# Altium project AMC_FMC_Carrier v3.PrjPcb (part 9 of 15)

## Sheet SUP_1.5_3.3.SchDoc
size A4; DocumentNumber: 13; SheetNumber: 13; SheetTotal: 30
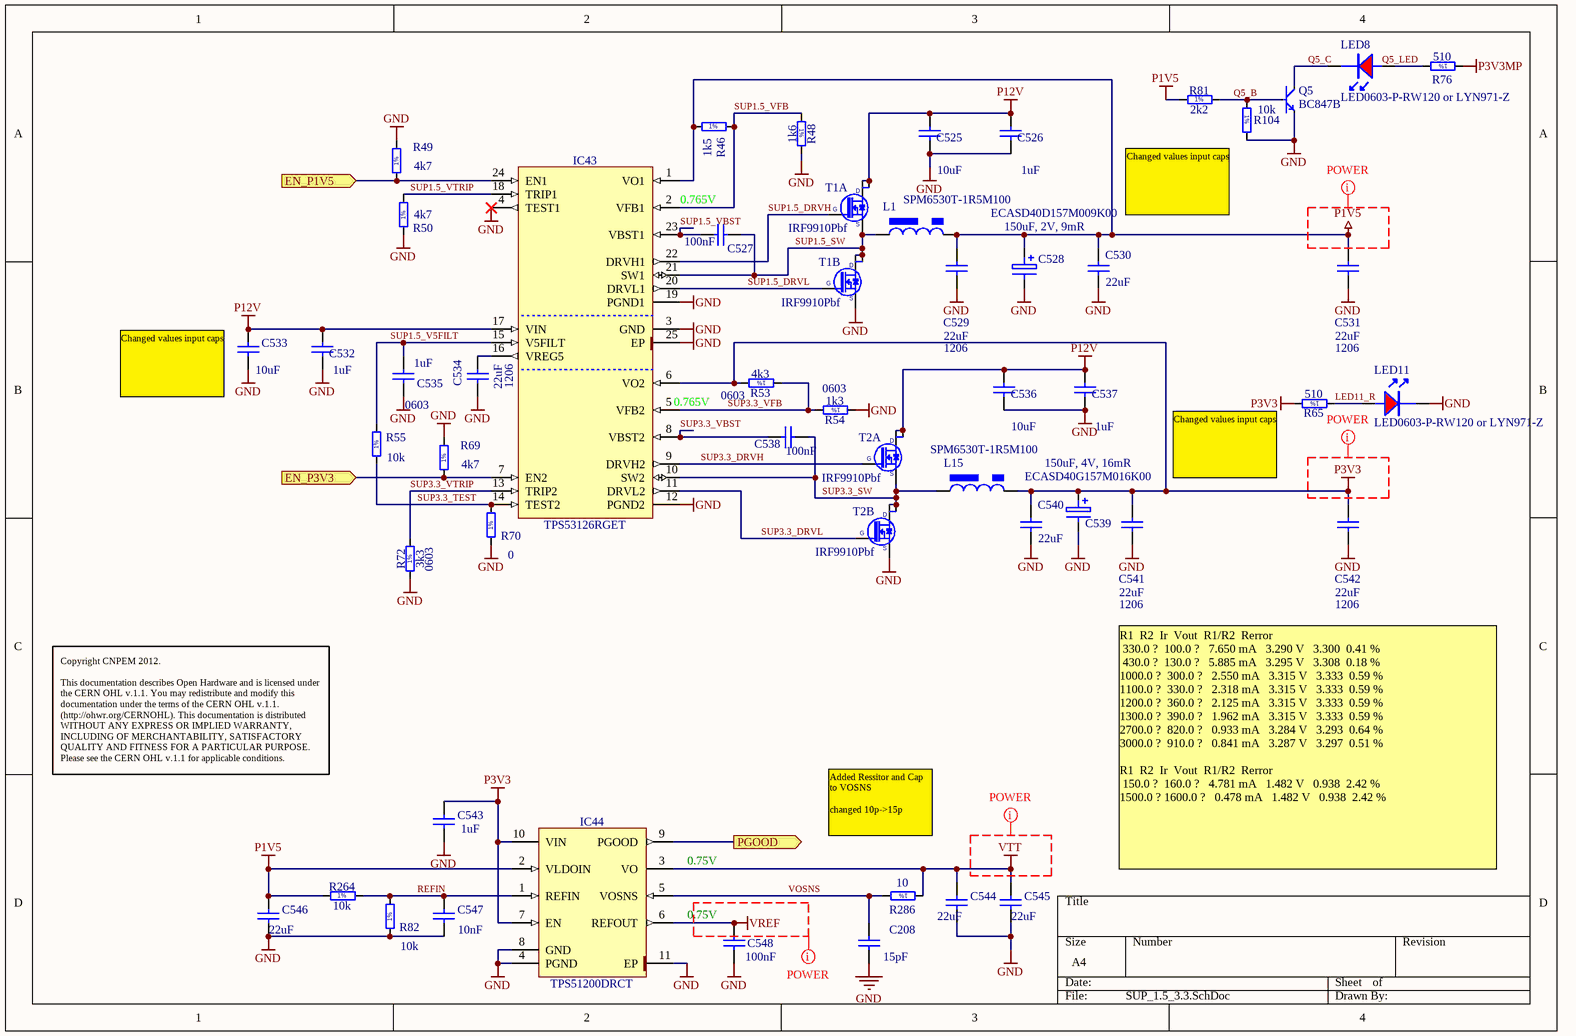
[diagram p16: SUP_1.5_3.3.SchDoc]

### Parts
C208  15pF  [CAPC1005X55N]
C525  10uF  [CAPC2012X135N]
C526  1uF  [CAPC1608X87N]
C527  100nF  [CAPC1005X55N]
C528  ECASD40D157M009K00  value 150uF, 2V, 9mR  [2917_POLY]
C529  22uF  Case: 1206  [CAPC3216X180N]
C530  22uF  [CAPC3216X180N]
C531  22uF  Case: 1206  [CAPC3216X180N]
C532  1uF  [CAPC1608X87N]
C533  10uF  [CAPC2012X135N]
C534  22uF  Case: 1206  [CAPC3216X180N]
C535  1uF  Case: 0603  [CAPC1608X87N]
C536  10uF  [CAPC2012X135N]
C537  1uF  [CAPC1608X87N]
C538  100nF  [CAPC1005X55N]
C539  ECASD40G157M016K00  value 150uF, 4V, 16mR  [2917_POLY]
C540  22uF  [CAPC3216X180N]
C541  22uF  Case: 1206  [CAPC3216X180N]
C542  22uF  Case: 1206  [CAPC3216X180N]
C543  1uF  [CAPC1608X87N]
C544  22uF  [CAPC3216X180N]
C545  22uF  [CAPC3216X180N]
C546  22uF  [CAPC3216X180N]
C547  10nF  [CAPC1005X55N]
C548  100nF  [CAPC0603X33N]
IC43  TPS53126RGET  [QFN50P400X400X100-25N-S255]
IC44  TPS51200DRCT  [SON50P300X300X100-11N-R175X250]
L1  SPM6530T-1R5M100  [IND_TDK_SPM6530]
L15  SPM6530T-1R5M100  [IND_TDK_SPM6530]
LED8  LED0603-P-RW120 or LYN971-Z  [led_0603R]
LED11  LED0603-P-RW120 or LYN971-Z  [led_0603R]
Q5  BC847B  [SOT-23]
R46  1k5  [RESC1608X55N]
R48  1k6  [RESC1608X55N]
R49  4k7  [RESC1005X40N]
R50  4k7  [RESC1005X40N]
R53  4k3  Case: 0603  [RESC1608X55N]
R54  1k3  Case: 0603  [RESC1608X55N]
R55  10k  [RESC1005X40N]
R65  510  [RESC1005X40N]
R69  4k7  [RESC1005X40N]
R70  0  [RESC1005X40N]
R72  3k3  Case: 0603  [RESC1608X55N]
R76  510  [RESC1005X40N]
R81  2k2  [RESC1005X40N]
R82  10k  [RESC1005X40N]
R104  10k  [RESC1005X40N]
R264  10k  [RESC1005X40N]
R286  10  [RESC1005X40N]
T1  IRF9910Pbf  [SOIC127P600X175-8N]  (parts A,B of 2)
T2  IRF9910Pbf  [SOIC127P600X175-8N]  (parts A,B of 2)

### Ports
EN_P1V5 (in), EN_P3V3 (in), PGOOD (out)

### Nets
GND: C208.2 C525.1 C526.1 C528.2 C529.2 C530.2 C531.2 C532.1 C533.1 C534.1 C535.1 C536.1 C537.1 C539.2 C540.2 C541.2 C542.2 C543.1 C544.1 C545.1 C546.1 C547.1 C548.1 IC43.3(GND) IC43.4(TEST1) IC43.12(PGND2) IC43.19(PGND1) IC43.25(EP) IC44.4(PGND) IC44.8(GND) IC44.11(EP) LED11.K Q5.2(E) R48.2 R49.2 R50.1 R54.1 R69.2 R70.1 R72.1 R82.1 R104.2 T1.1(S) T2.1(S)
P1V5: C528.1 C529.1 C530.1 C531.1 C546.2 IC43.1(VO1) IC44.2(VLDOIN) L1.2 R46.1 R81.1 R264.1
P3V3: C539.1 C540.1 C541.1 C542.1 C543.2 IC43.6(VO2) IC44.7(EN) IC44.10(VIN) L15.2 R53.2 R65.2
P3V3MP: R76.1
P12V: C525.2 C526.2 C532.2 C533.2 C536.2 C537.2 IC43.17(VIN) T1.5(D) T1.6(D) T2.5(D) T2.6(D)
VREF: C548.2 IC44.6(REFOUT)
VTT: C544.2 C545.2 IC44.3(VO) R286.1
LED11_R: LED11.A R65.1
PM.1V5_VTT_EN: IC43.24(EN1) R49.1 ; port EN_P1V5
PM.EN_P3V3: IC43.7(EN2) R69.1 ; port EN_P3V3
PM.PGOOD_P1V0: IC44.9(PGOOD) ; port PGOOD
Q5_B: Q5.1(B) R81.2 R104.1
Q5_C: LED8.K Q5.3(C)
REFIN: C547.2 IC44.1(REFIN) R82.2 R264.2
SUP1.5_DRVH: IC43.22(DRVH1) T1.4(G)
SUP1.5_DRVL: IC43.20(DRVL1) T1.2(G)
SUP1.5_SW: C527.1 IC43.21(SW1) L1.1 T1.3(S) T1.7(D) T1.8(D)
SUP1.5_V5FILT: C535.2 IC43.15(V5FILT) R55.2
SUP1.5_VBST: C527.2 IC43.23(VBST1)
SUP1.5_VFB: IC43.2(VFB1) R46.2 R48.1
SUP1.5_VTRIP: IC43.18(TRIP1) R50.2
SUP3.3_DRVH: IC43.9(DRVH2) T2.4(G)
SUP3.3_DRVL: IC43.11(DRVL2) T2.2(G)
SUP3.3_SW: C538.1 IC43.10(SW2) L15.1 T2.3(S) T2.7(D) T2.8(D)
SUP3.3_TEST: IC43.14(TEST2) R55.1 R70.2
SUP3.3_VBST: C538.2 IC43.8(VBST2)
SUP3.3_VFB: IC43.5(VFB2) R53.1 R54.2
SUP3.3_VTRIP: IC43.13(TRIP2) R72.2
VOSNS: C208.1 IC44.5(VOSNS) R286.2
NetC534_2: C534.2 IC43.16(VREG5)
NetLED8_A: LED8.A R76.2

### Layout directives
net class POWER: P1V5, P3V3, VREF, VTT

### Notes on the sheet
- 0.765V
- (near R104) Changed values input caps
- (near C533) Changed values input caps
- (near IC43) 0.765V
- (near R65) Changed values input caps
- Copyright CNPEM 2012.
  This documentation describes Open Hardware and is licensed under the CERN OHL v.1.1. You may redistribute and modify this documentation under the terms of the CERN OHL v.1.1. (http://ohwr.org/CERNOHL). This documentation is distributed WITHOUT ANY EXPRESS OR IMPLIED WARRANTY, INCLUDING OF MERCHANTABILITY, SATISFACTORY QUALITY AND FITNESS FOR A PARTICULAR PURPOSE. Please see the CERN OHL v.1.1 for applicable conditions.
- Added Ressitor and Cap to VOSNS
  changed 10p->15p
- (near IC44) 0.75V
- (near C548) 0.75V
- R1 	R2 	Ir 	Vout 	R1/R2 	Rerror
  330.0 ?	 100.0 ?	  7.650 mA	  3.290 V	  3.300	 0.41 %
  430.0 ?	 130.0 ?	  5.885 mA	  3.295 V	  3.308	 0.18 %
  1000.0 ?	 300.0 ?	  2.550 mA	  3.315 V	  3.333	 0.59 %
  1100.0 ?	 330.0 ?	  2.318 mA	  3.315 V	  3.333	 0.59 %
  1200.0 ?	 360.0 ?	  2.125 mA	  3.315 V	  3.333	 0.59 %
  1300.0 ?	 390.0 ?	  1.962 mA	  3.315 V	  3.333	 0.59 %
  2700.0 ?	 820.0 ?	  0.933 mA	  3.284 V	  3.293	 0.64 %
  3000.0 ?	 910.0 ?	  0.841 mA	  3.287 V	  3.297	 0.51 %
  R1 	R2 	Ir 	Vout 	R1/R2 	Rerror
  150.0 ?	 160.0 ?	  4.781 mA	  1.482 V	  0.938	 2.42 %
  1500.0 ?	1600.0 ?	  0.478 mA	  1.482 V	  0.938	 2.42 %
- Labels drawn without touching a wire or pin: Q5_LED
- (in symbol R0402_0R_JUMPER) 1%
- (in symbol R0402_2K2_1%_0.0625W_100PPM) 1%
- (in symbol R0402_4K7_1%_0.0625W_100PPM) 1%
- (in symbol R0402_10K_1%_0.0625W_100PPM) 1%
- (in symbol R0402_10R_1%_0.0625W_200PPM) 1%
- (in symbol R0402_510R_1%_0.0625W_100PPM) 1%
- (in symbol R0603_1K3_1%_0.1W_100PPM) 1%
- (in symbol R0603_1K5_1%_0.1W_100PPM) 1%
- (in symbol R0603_1K6_1%_0.1W_100PPM) 1%
- (in symbol R0603_3K3_1%_0.1W_100PPM) 1%
- (in symbol R0603_4K3_1%_0.1W_100PPM) 1%

### Library data of the parts
C208 = CC0402_15PF_50V_5%_NP0: Non-polarised capacitor; Part Description: SMD Multilayer Chip Ceramic Capacitor; Manufacturer: GENERIC; Manufacturer1 Part Number: 223886915159; Voltage: 50V; TC: NP0; Tolerance: ±5%; Table: Capacitors SMD; Part Number: CC0402_15PF_50V_5%_NP0; Component Kind: Standard; Component Type: Standard; Pin Count: 2; Value: 15pF; Status: Not Recommended; Manufacturer Part Number: CC0402_15PF_50V_5%_NP0; Case: 0402; Mounted: Yes; Socket: No; SMD: Yes; Manufacturer1 Example: PHYCOMP; Manufacturer1 ComponentHeight: 0.55mm; HelpURL: \\cern.ch\dfs\Applications\Altium\Datasheets\CC0402_NP0_PHYCOMP.pdf; Author: CERN DEM JLC; CreateDate: 2007-12-03; LatestRevisionDate: 2007-12-03
C525 C533 C536 = CC0805_10UF_16V_10%_X5R: Non-polarised capacitor; Part Description: SMD Multilayer Chip Ceramic Capacitor; Manufacturer: GENERIC; Manufacturer1 Part Number: C0805C106K4PAC; Voltage: 16V; TC: X5R; Tolerance: ±10%; Table: Capacitors SMD; Part Number: CC0805_10UF_16V_10%_X5R; Component Kind: Standard; Component Type: Standard; Pin Count: 2; Value: 10uF; Status: Preferred; Manufacturer Part Number: CC0805_10UF_16V_10%_X5R; Case: 0805; Mounted: Yes; Socket: No; SMD: Yes; Manufacturer1 Example: KEMET; Manufacturer1 ComponentHeight: 1.4mm; HelpURL: \\cern.ch\dfs\Applications\Altium\Datasheets\CC1206_X5R_KEMET.pdf; Author: CERN DEM JLC; CreateDate: 2007-12-03; LatestRevisionDate: 2007-12-03
C526 C532 C535 C537 C543 = CC0603_1UF_16V_10%_X7R: as C816 on sheet POWER_Management; Part Number: CC0603_1UF_16V_10%_X7R; Component Kind: Standard; Component Type: Standard; Pin Count: 2; Value: 1uF; Status: Preferred; Manufacturer Part Number: CC0603_1uF_16V_10%_X7R; Mounted: Yes; Socket: No; SMD: Yes; Manufacturer1 Example: PHYCOMP; Manufacturer1 ComponentHeight: 0.87mm; HelpURL: \\cern.ch\dfs\Applications\Altium\Datasheets\CC0805_X5R_PHYCOMP_HC.pdf; Author: CERN DEM JLC
  C526 C532 C537: Case: 0603; CreateDate: 2007-12-03; LatestRevisionDate: 2007-12-03
  C535: CreateDate: 03/12/2007; LatestRevisionDate: 03/12/2007
  C543: Case: 0603; CreateDate: 03/12/2007; LatestRevisionDate: 03/12/2007
C527 C538 = CC0402_100NF_16V_10%_X7R: Non-polarised capacitor; Part Description: SMD Multilayer Chip Ceramic Capacitor; Manufacturer: GENERIC; Manufacturer1 Part Number: 223878715649; Voltage: 16V; TC: X7R; Tolerance: ±10%; Table: Capacitors SMD; Part Number: CC0402_100NF_16V_10%_X7R; Component Kind: Standard; Component Type: Standard; Pin Count: 2; Value: 100nF; Status: Not Recommended; Manufacturer Part Number: CC0402_100NF_16V_10%_X7R; Case: 0402; Mounted: Yes; Socket: No; SMD: Yes; Manufacturer1 Example: PHYCOMP; Manufacturer1 ComponentHeight: 0.55mm; HelpURL: \\cern.ch\dfs\Applications\Altium\Datasheets\CC0402_X7R_PHYCOMP.pdf; Author: CERN DEM JLC; CreateDate: 2007-12-03; LatestRevisionDate: 2007-12-03
C528 = CAP_POLYMER: POLY, 150uF, 2V, ESR: 9mR
C529-C531 C534 C540-C542 C544-C546 = CC1206_22UF_10V_10%_X7R: Non-polarised capacitor; Part Description: SMD Multilayer Chip Ceramic Capacitor; Manufacturer: GENERIC; Manufacturer1 Part Number: GRM31CR71A226KE15L; Voltage: 10V; TC: X7R; Tolerance: ±10%; Table: Capacitors SMD; Part Number: CC1206_22UF_10V_10%_X7R; Component Kind: Standard; Component Type: Standard; Pin Count: 2; Value: 22uF; Status: Preferred; Manufacturer Part Number: CC1206_22UF_10V_10%_X7R; Mounted: Yes; Socket: No; SMD: Yes; Manufacturer1 Example: MURATA; Manufacturer1 ComponentHeight: 1.8mm; HelpURL: \\cern.ch\dfs\Applications\Altium\Datasheets\CC1206_X7R_MURATA_GRM-HI-CAP.pdf; Author: CERN DEM JLC
  C529-C531 C534 C541 C542: CreateDate: 08/06/2010; LatestRevisionDate: 08/06/2010
  C540 C544-C546: Case: 1206; CreateDate: 2010-06-08; LatestRevisionDate: 2010-06-08
C539 = CAP_POLYMER_SMDD: POLY, 150uF, 4V, ESR: 16mR
C547 = CC0402_10NF_16V_10%_X7R: Non-polarised capacitor; Part Description: SMD Multilayer Chip Ceramic Capacitor; Manufacturer: GENERIC; Manufacturer1 Part Number: 223878715636; Voltage: 16V; TC: X7R; Tolerance: ±10%; Table: Capacitors SMD; Part Number: CC0402_10NF_16V_10%_X7R; Component Kind: Standard; Component Type: Standard; Pin Count: 2; Value: 10nF; Status: Not Recommended; Manufacturer Part Number: CC0402_10NF_16V_10%_X7R; Case: 0402; Mounted: Yes; Socket: No; SMD: Yes; Manufacturer1 Example: PHYCOMP; Manufacturer1 ComponentHeight: 0.55mm; HelpURL: \\cern.ch\dfs\Applications\Altium\Datasheets\CC0402_X7R_PHYCOMP.pdf; Author: CERN DEM JLC; CreateDate: 2007-12-03; LatestRevisionDate: 2007-12-03
C548 = CC0201_100NF_6.3V_10%_X5R: as C20 on sheet POWER_Management; Part Number: CC0201_100NF_6.3V_10%_X5R; Component Kind: Standard; Component Type: Standard; Pin Count: 2; Value: 100nF; Status: Not Recommended; Manufacturer Part Number: CC0201_100NF_6.3V_10%_X5R; Case: 0201; Mounted: Yes; Socket: No; SMD: Yes; Manufacturer1 Example: AVX; Manufacturer1 ComponentHeight: 0.33mm; HelpURL: \\cern.ch\dfs\Applications\Altium\Datasheets\CC0201_X5R_AVX.pdf; Author: CERN DEM JLC; CreateDate: 2007-12-03; LatestRevisionDate: 2007-12-03
IC43 = TPS53126RGET: as IC10 on sheet SUP_2.5_FMC; Part Number: TPS53126RGET; Component Kind: Standard; Component Type: Standard; Device: TPS53126RGET; PackageDescription: QFN,0.50mm pitch,square;6 pin X 6 pin,4.15mm X 4.15mm X 1.00mm H body (w/thermal tab 2.55 X 2.55mm),  IPC Medium Density; Part Description: Dual Synchronous Step-Down Controller For Low Voltage Power Rails; Manufacturer Part Number: TPS53126RGET; Pin Count: 25; Case: QFN24; Mounted: Yes; Socket: No; SMD: Yes; ComponentHeight: 1.0mm; Author: CERN DEM JLC; HelpURL: \\cern.ch\dfs\Applications\Altium\Datasheets\TPS53126RGET.pdf; CreateDate: 2010-08-26; LatestRevisionDate: 2010-08-26
IC44 = TPS51200DRCT: Sink/Source DDR Termination Regulator; Part Description: 3.3V Sink/Source DDR Termination Regulator; Manufacturer: TEXAS INSTRUMENTS; Table: Regulators; Part Number: TPS51200DRCT; Component Kind: Standard; Component Type: Standard; Device: TPS51200DRCT; PackageDescription: SON, 0.50mm Pitch, 10-pin, 3.00mm W  X 3.00mm L X 1.00mm Height, (w/thermal tab 1.75 X 2.50 mm), IPC Medium Density; Manufacturer Part Number: TPS51200DRCT; Pin Count: 10; Case: SON10; Mounted: Yes; Socket: No; SMD: Yes; ComponentHeight: 1mm; HelpURL: \\cern.ch\dfs\Applications\Altium\Datasheets\TPS51200DRCT.pdf; Author: CERN DEM JLC; CreateDate: 2/3/2010; LatestRevisionDate: 2/3/2010
L1 L15 = L_POWER_SPM6530T: 1.5uH, 20%, 10mR, 11.5A; Supplier 1: Arrow; Supplier Part Number 1: 51419938S48550N1165
LED8 LED11 = LED_0603R: LED 0603 red; Supplier 1: Newark; Supplier Part Number 1: 22M3004; Supplier 2: Newark; Supplier Part Number 2: 20M0618
Q5 = Q_BC847B: Transistor
R46 = R0603_1K5_1%_0.1W_100PPM: as R247 on sheet SUP_2.5_FMC; Part Number: R0603_1K5_1%_0.1W_100PPM; Component Kind: Standard; Component Type: Standard; Pin Count: 2; Value: 1k5; Status: Preferred; Tolerance: ±1%; Manufacturer Part Number: R0603_1K5_1%_0.1W_100PPM; Case: 0603; Mounted: Yes; Socket: No; SMD: Yes; Manufacturer1 Example: NIC COMPONENT; Manufacturer1 ComponentHeight: 0.55mm; HelpURL: \\cern.ch\dfs\Applications\Altium\Datasheets\R0603_NIC_NRC.pdf; Author: CERN DEM JLC; CreateDate: 2007-12-03; LatestRevisionDate: 2008-03-13
R48 = R0603_1K6_1%_0.1W_100PPM: Resistor - 1%; Part Description: General Purpose Thick Film Chip Resistor; Manufacturer: GENERIC; Manufacturer1 Part Number: NRC06F1601TRF; Power: 0.1W; TC: ±100ppm/°C; Table: Resistors SMD; Part Number: R0603_1K6_1%_0.1W_100PPM; Component Kind: Standard; Component Type: Standard; Pin Count: 2; Value: 1k6; Status: Preferred; Tolerance: ±1%; Manufacturer Part Number: R0603_1K6_1%_0.1W_100PPM; Case: 0603; Mounted: Yes; Socket: No; SMD: Yes; Manufacturer1 Example: NIC COMPONENT; Manufacturer1 ComponentHeight: 0.55mm; HelpURL: \\cern.ch\dfs\Applications\Altium\Datasheets\R0603_NIC_NRC.pdf; Author: CERN DEM JLC; CreateDate: 2007-12-03; LatestRevisionDate: 2008-03-13
R49 R50 R69 = R0402_4K7_1%_0.0625W_100PPM: Resistor - 1%; Part Description: General Purpose Thick Film Chip Resistor; Manufacturer: GENERIC; Manufacturer1 Part Number: 232270674702L; TC: ±100ppm/°C; Table: Resistors SMD; Part Number: R0402_4K7_1%_0.0625W_100PPM; Component Kind: Standard; Component Type: Standard; Pin Count: 2; Value: 4k7; Status: Not recommended; Power: 0.0625W; Tolerance: ±1%; Manufacturer Part Number: R0402_4K7_1%_0.0625W_100PPM; Case: 0402; Mounted: Yes; Socket: No; SMD: Yes; Manufacturer1 Example: YAGEO PHYCOMP; Manufacturer1 ComponentHeight: 0.4mm; HelpURL: \\cern.ch\dfs\Applications\Altium\Datasheets\R0402_Phycomp_RC0402.pdf; Author: CERN DEM JLC; CreateDate: 2007-12-03; LatestRevisionDate: 2012-10-17
R53 = R0603_4K3_1%_0.1W_100PPM: as R84 on sheet SUP_3.3_FMC; Part Number: R0603_4K3_1%_0.1W_100PPM; Component Kind: Standard; Component Type: Standard; Pin Count: 2; Value: 4k3; Status: Preferred; Tolerance: ±1%; Manufacturer Part Number: R0603_4K3_1%_0.1W_100PPM; Mounted: Yes; Socket: No; SMD: Yes; Manufacturer1 Example: NIC COMPONENT; Manufacturer1 ComponentHeight: 0.55mm; HelpURL: \\cern.ch\dfs\Applications\Altium\Datasheets\R0603_NIC_NRC.pdf; Author: CERN DEM JLC; CreateDate: 2007-12-03; LatestRevisionDate: 2008-03-13
R54 = R0603_1K3_1%_0.1W_100PPM: as R86 on sheet SUP_3.3_FMC; Part Number: R0603_1K3_1%_0.1W_100PPM; Component Kind: Standard; Component Type: Standard; Pin Count: 2; Value: 1k3; Status: Preferred; Tolerance: ±1%; Manufacturer Part Number: R0603_1K3_1%_0.1W_100PPM; Mounted: Yes; Socket: No; SMD: Yes; Manufacturer1 Example: NIC COMPONENT; Manufacturer1 ComponentHeight: 0.55mm; HelpURL: \\cern.ch\dfs\Applications\Altium\Datasheets\R0603_NIC_NRC.pdf; Author: CERN DEM JLC; CreateDate: 2007-12-03; LatestRevisionDate: 2008-03-13
R55 R82 R104 R264 = R0402_10K_1%_0.0625W_100PPM: as R37-R40 on sheet POWER_Management; Part Number: R0402_10K_1%_0.0625W_100PPM; Component Kind: Standard; Component Type: Standard; Pin Count: 2; Value: 10k; Status: Not recommended; Power: 0.0625W; Tolerance: ±1%; Manufacturer Part Number: R0402_10K_1%_0.0625W_100PPM; Case: 0402; Mounted: Yes; Socket: No; SMD: Yes; Manufacturer1 Example: YAGEO PHYCOMP; Manufacturer1 ComponentHeight: 0.4mm; HelpURL: \\cern.ch\dfs\Applications\Altium\Datasheets\R0402_Phycomp_RC0402.pdf; Author: CERN DEM JLC; CreateDate: 2007-12-03; LatestRevisionDate: 2012-10-17
R65 R76 = R0402_510R_1%_0.0625W_100PPM: as R74 on sheet SUP_2.5_FMC; Part Number: R0402_510R_1%_0.0625W_100PPM; Component Kind: Standard; Component Type: Standard; Pin Count: 2; Value: 510; Status: Not recommended; Power: 0.0625W; Tolerance: ±1%; Manufacturer Part Number: R0402_510R_1%_0.0625W_100PPM; Case: 0402; Mounted: Yes; Socket: No; SMD: Yes; Manufacturer1 Example: PHYCOMP; Manufacturer1 ComponentHeight: 0.4mm; HelpURL: \\cern.ch\dfs\Applications\Altium\Datasheets\R0402_Phycomp_RC0402.pdf; Author: CERN DEM JLC; CreateDate: 2007-12-03; LatestRevisionDate: 2008-03-13
R70 = R0402_0R_JUMPER: Resistor - 1%; Part Description: 1A (0.05R Max DC Resistance) Zero Ohm Jumper; Manufacturer: GENERIC; Manufacturer1 Part Number: 232270591001L; Table: Resistors SMD; Part Number: R0402_0R_JUMPER; Component Kind: Standard; Component Type: Standard; Pin Count: 2; Value: 0; Status: Not recommended; Manufacturer Part Number: R0402_0R_JUMPER; Case: 0402; Mounted: Yes; Socket: No; SMD: Yes; Manufacturer1 Example: YAGEO PHYCOMP; Manufacturer1 ComponentHeight: 0.4mm; HelpURL: \\cern.ch\dfs\Applications\Altium\Datasheets\R0402_Phycomp_RC0402.pdf; Author: CERN DEM JLC; CreateDate: 2007-12-03; LatestRevisionDate: 2012-10-17
R72 = R0603_3K3_1%_0.1W_100PPM: Resistor - 1%; Part Description: General Purpose Thick Film Chip Resistor; Manufacturer: GENERIC; Manufacturer1 Part Number: NRC06F3301TRF; Power: 0.1W; TC: ±100ppm/°C; Table: Resistors SMD; Part Number: R0603_3K3_1%_0.1W_100PPM; Component Kind: Standard; Component Type: Standard; Pin Count: 2; Value: 3k3; Status: Preferred; Tolerance: ±1%; Manufacturer Part Number: R0603_3K3_1%_0.1W_100PPM; Mounted: Yes; Socket: No; SMD: Yes; Manufacturer1 Example: NIC COMPONENT; Manufacturer1 ComponentHeight: 0.55mm; HelpURL: \\cern.ch\dfs\Applications\Altium\Datasheets\R0603_NIC_NRC.pdf; Author: CERN DEM JLC; CreateDate: 2007-12-03; LatestRevisionDate: 2008-03-13
R81 = R0402_2K2_1%_0.0625W_100PPM: Resistor - 1%; Part Description: General Purpose Thick Film Chip Resistor; Manufacturer: GENERIC; Manufacturer1 Part Number: 232270672202L; TC: ±100ppm/°C; Table: Resistors SMD; Part Number: R0402_2K2_1%_0.0625W_100PPM; Component Kind: Standard; Component Type: Standard; Pin Count: 2; Value: 2k2; Status: Not recommended; Power: 0.0625W; Tolerance: ±1%; Manufacturer Part Number: R0402_2K2_1%_0.0625W_100PPM; Case: 0402; Mounted: Yes; Socket: No; SMD: Yes; Manufacturer1 Example: YAGEO PHYCOMP; Manufacturer1 ComponentHeight: 0.4mm; HelpURL: \\cern.ch\dfs\Applications\Altium\Datasheets\R0402_Phycomp_RC0402.pdf; Author: CERN DEM JLC; CreateDate: 2007-12-03; LatestRevisionDate: 2012-10-17
R286 = R0402_10R_1%_0.0625W_200PPM: Resistor - 1%; Part Description: General Purpose Thick Film Chip Resistor; Manufacturer: GENERIC; Manufacturer1 Part Number: 232270671009L; TC: ±200ppm/°C; Table: Resistors SMD; Part Number: R0402_10R_1%_0.0625W_200PPM; Component Kind: Standard; Component Type: Standard; Pin Count: 2; Value: 10; Status: Not recommended; Power: 0.0625W; Tolerance: ±1%; Manufacturer Part Number: R0402_10R_1%_0.0625W_200PPM; Case: 0402; Mounted: Yes; Socket: No; SMD: Yes; Manufacturer1 Example: YAGEO PHYCOMP; Manufacturer1 ComponentHeight: 0.4mm; HelpURL: \\cern.ch\dfs\Applications\Altium\Datasheets\R0402_Phycomp_RC0402.pdf; Author: CERN DEM JLC; CreateDate: 2009-06-24; LatestRevisionDate: 2012-10-17
T1 T2 = IRF9910Pbf: as T3 on sheet SUP_2.5_FMC; Part Number: IRF9910Pbf; Component Kind: Standard; Component Type: Standard; Device: IRF9910Pbf; PackageDescription: SOIC 8, Pitch 1.27mm - Body 4x5mm, IPC Medium Density; Manufacturer Part Number: IRF9910Pbf; Pin Count: 8; Case: DO8; Mounted: Yes; Socket: No; SMD: Yes; ComponentHeight: 1.75mm; HelpURL: \\cern.ch\dfs\Applications\Altium\Datasheets\IRF9910Pbf.pdf; Author: CERN DEM JLC; CreateDate: 2010-08-30; LatestRevisionDate: 2010-08-30

## Sheet SUP_1.2_1.8.SchDoc
size A4; DocumentNumber: 6; SheetNumber: 6; SheetTotal: 30
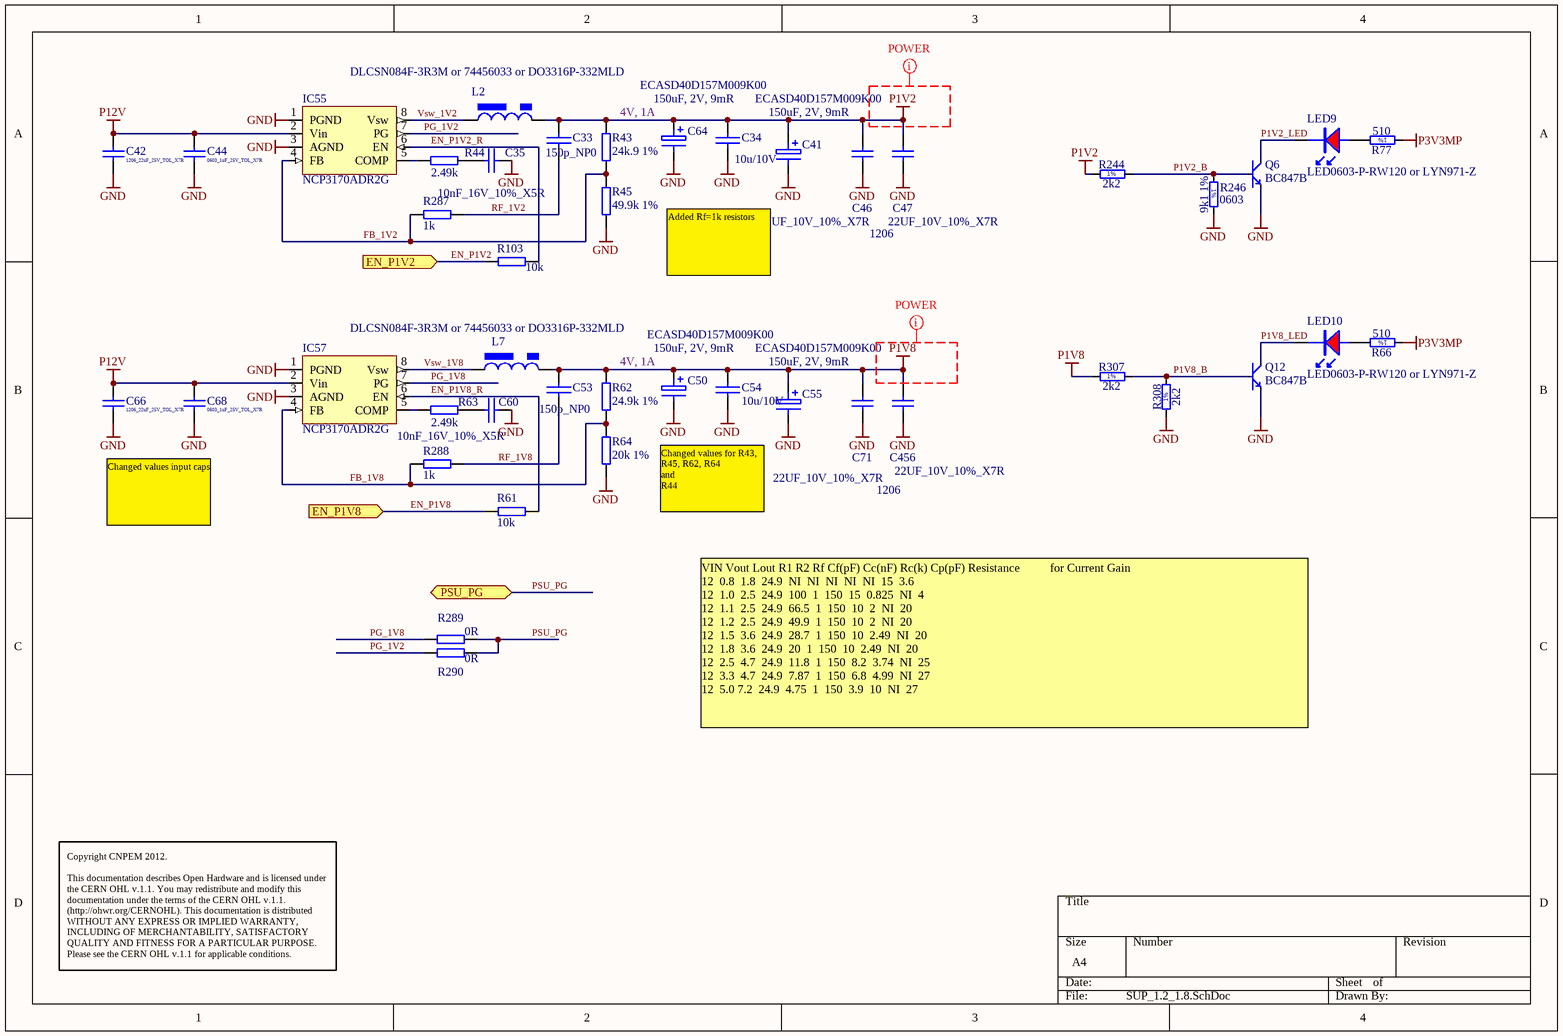
[diagram p17: SUP_1.2_1.8.SchDoc]

### Parts
C33  150p_NP0  [0603C]
C34  10u/10V  [0805C]
C35  10nF_16V_10%_X5R  [0603C]
C41  ECASD40D157M009K00  value 150uF, 2V, 9mR  [2917_POLY]
C42  1206_22uF_25V_TOL_X7R  [CAPC3225X140N]
C44  0603_1uF_25V_TOL_X7R  [CAPC1608X90N]
C46  22UF_10V_10%_X7R  [1206C]
C47  22UF_10V_10%_X7R  Case: 1206  [1206C]
C50  ECASD40D157M009K00  value 150uF, 2V, 9mR  [2917_POLY]
C53  150p_NP0  [0603C]
C54  10u/10V  [0805C]
C55  ECASD40D157M009K00  value 150uF, 2V, 9mR  [2917_POLY]
C60  10nF_16V_10%_X5R  [0603C]
C64  ECASD40D157M009K00  value 150uF, 2V, 9mR  [2917_POLY]
C66  1206_22uF_25V_TOL_X7R  [CAPC3225X140N]
C68  0603_1uF_25V_TOL_X7R  [CAPC1608X90N]
C71  22UF_10V_10%_X7R  [1206C]
C456  22UF_10V_10%_X7R  Case: 1206  [1206C]
IC55  NCP3170ADR2G  [so-8]
IC57  NCP3170ADR2G  [so-8]
L2  DLCSN084F-3R3M or 74456033 or DO3316P-332MLD  [IND_CSN084F]
L7  DLCSN084F-3R3M or 74456033 or DO3316P-332MLD  [IND_CSN084F]
LED9  LED0603-P-RW120 or LYN971-Z  [led_0603R]
LED10  LED0603-P-RW120 or LYN971-Z  [led_0603R]
Q6  BC847B  [SOT-23]
Q12  BC847B  [SOT-23]
R43  24k.9 1%  [0603R]
R44  2.49k  [0603R]
R45  49.9k 1%  [0603R]
R61  10k  [0402R]
R62  24.9k 1%  [0603R]
R63  2.49k  [0603R]
R64  20k 1%  [0603R]
R66  510  [0603R]
R77  510  [0603R]
R103  10k  [0402R]
R244  2k2  [RESC1608X55N]
R246  9k1 1%  Case: 0603  [0603R]
R287  1k  [0603R]
R288  1k  [0603R]
R289  0R  [0402R]
R290  0R  [0402R]
R307  2k2  [RESC1608X55N]
R308  2k2  [RESC1608X55N]

### Ports
EN_P1V2 (in), EN_P1V8 (in), PSU_PG

### Nets
GND: C34.2 C35.2 C41.2 C42.1 C44.1 C46.2 C47.2 C50.2 C54.2 C55.2 C60.2 C64.2 C66.1 C68.1 C71.2 C456.2 IC55.1(PGND) IC55.3(AGND) IC57.1(PGND) IC57.3(AGND) Q6.2(E) Q12.2(E) R45.1 R64.1 R246.2 R308.1
P1V2: C33.1 C34.1 C41.1 C46.1 C47.1 C64.1 L2.2 R43.2 R244.1
P1V8: C50.1 C53.1 C54.1 C55.1 C71.1 C456.1 L7.2 R62.2 R307.1
P3V3MP: R66.1 R77.1
P12V: C42.2 C44.2 C66.2 C68.2 IC55.2(Vin) IC57.2(Vin)
EN_P1V2: R103.1 ; port EN_P1V2  [project net PM.EN_P1V2]
EN_P1V2_R: IC55.6(EN) R103.2
EN_P1V8: R61.1 ; port EN_P1V8  [project net PM.EN_P1V8]
EN_P1V8_R: IC57.6(EN) R61.2
FB_1V2: IC55.4(FB) R43.1 R45.2 R287.2
FB_1V8: IC57.4(FB) R62.1 R64.2 R288.2
P1V2_B: Q6.1(B) R244.2 R246.1
P1V2_LED: LED9.K Q6.3(C)
P1V8_B: Q12.1(B) R307.2 R308.2
P1V8_LED: LED10.K Q12.3(C)
PG_1V2: IC55.7(PG) R290.2
PG_1V8: IC57.7(PG) R289.2
PSU_PG: R289.1 R290.1 ; port PSU_PG  [project net PM.PGOOD_P1V0]
RF_1V2: C33.2 R287.1
RF_1V8: C53.2 R288.1
Vsw_1V2: IC55.8(Vsw) L2.1
Vsw_1V8: IC57.8(Vsw) L7.1
NetC35_1: C35.1 R44.1
NetC60_1: C60.1 R63.1
NetIC55_5: IC55.5(COMP) R44.2
NetIC57_5: IC57.5(COMP) R63.2
NetLED9_A: LED9.A R77.2
NetLED10_A: LED10.A R66.2

### Layout directives
net class POWER: P1V2, P1V8

### Notes on the sheet
- 4V, 1A
- Added Rf=1k resistors
- Changed values input caps
- Changed values for R43, R45, R62, R64
  and
  R44
- VIN	Vout	Lout	R1	R2	Rf	Cf(pF)	Cc(nF)	Rc(k)	Cp(pF) Resistance 									for Current Gain
  12 	0.8 	1.8 	24.9 	NI 	NI 	NI 	NI 	NI 	15 	3.6
  12 	1.0 	2.5 	24.9 	100 	1 	150 	15 	0.825 	NI 	4
  12 	1.1 	2.5 	24.9 	66.5 	1 	150 	10 	2 	NI 	20
  12 	1.2 	2.5 	24.9 	49.9 	1 	150 	10 	2 	NI 	20
  12 	1.5 	3.6 	24.9 	28.7 	1 	150 	10 	2.49 	NI 	20
  12 	1.8 	3.6 	24.9 	20 	1 	150 	10 	2.49 	NI 	20
  12 	2.5 	4.7 	24.9 	11.8 	1 	150 	8.2 	3.74 	NI 	25
  12 	3.3 	4.7 	24.9 	7.87 	1 	150 	6.8 	4.99 	NI 	27
  12 	5.0	7.2 	24.9 	4.75 	1 	150 	3.9 	10 	NI 	27
- Copyright CNPEM 2012.
  This documentation describes Open Hardware and is licensed under the CERN OHL v.1.1. You may redistribute and modify this documentation under the terms of the CERN OHL v.1.1. (http://ohwr.org/CERNOHL). This documentation is distributed WITHOUT ANY EXPRESS OR IMPLIED WARRANTY, INCLUDING OF MERCHANTABILITY, SATISFACTORY QUALITY AND FITNESS FOR A PARTICULAR PURPOSE. Please see the CERN OHL v.1.1 for applicable conditions.
- (in symbol R0402_510R_1%_0.0625W_100PPM) 1%
- (in symbol R0603_2K2_1%_0.1W_100PPM) 1%
- (in symbol R0603_9K1_1%_0.1W_100PPM) 1%

### Library data of the parts
C33 C35 C53 C60 = CAP_SMD_0603: Capacitor SMD
C34 C54 = CAP_SMD_0805: Capacitor SMD; Supplier 1: Farnell; Supplier Part Number 1: 1833812
C41 C50 C55 C64 = CAP_POLYMER: POLY, 150uF, 2V, ESR: 9mR
C42 C66 = Ceramic_1206: MiscInfo: Biggest Cern Footprint [max height]; Document Name: SUP_1.2_1.8.SchDoc; Part Number: Ceramic_1206; FootprintSizeX (mm): 4.65; FootprintSizeY (mm): 2.3; FootprintRectangleArea (mm): 10.7; Thickness (Max) (mm): 1.8; FootprintAlias: 1206
C44 C68 = Ceramic_0603: MiscInfo: Biggest Cern Footprint [max height]; Document Name: SUP_1.2_1.8.SchDoc; Part Number: Ceramic_0603; FootprintSizeX (mm): 3; FootprintSizeY (mm): 1.5; FootprintRectangleArea (mm): 4.5; Thickness (Max) (mm): 0.9; FootprintAlias: 0603
C46 C47 C71 C456 = CC1206_22UF_10V_10%_X7R: as C79 on sheet SUP_2.5_FMC; Part Number: CC1206_22UF_10V_10%_X7R; Component Kind: Standard; Component Type: Standard; Footprint: CAPC3216X180N; Pin Count: 2; Status: Preferred; Manufacturer Part Number: CC1206_22UF_10V_10%_X7R; Mounted: Yes; Socket: No; SMD: Yes; Manufacturer1 Example: MURATA; Manufacturer1 ComponentHeight: 1.8mm; HelpURL: \\cern.ch\dfs\Applications\Altium\Datasheets\CC1206_X7R_MURATA_GRM-HI-CAP.pdf; Author: CERN DEM JLC; CreateDate: 08/06/2010; LatestRevisionDate: 08/06/2010
IC55 IC57 = PWM_NCP3170: 4.5V to 18V, 3A synch buck
L2 L7 = L_POWER_CSN084F_3R3: 3.3uH, 20%, 5.4A, 0.015R
LED9 LED10 = LED_0603R: LED 0603 red; Supplier 1: Newark; Supplier Part Number 1: 22M3004; Supplier 2: Newark; Supplier Part Number 2: 20M0618
Q6 Q12 = Q_BC847B: Transistor
R43-R45 R62-R64 R287 R288 = RES_0603: SMD Resistor
R61 R103 = RES_SMD: SMD Resistor
R66 R77 = R0402_510R_1%_0.0625W_100PPM: as R74 on sheet SUP_2.5_FMC; Part Number: R0402_510R_1%_0.0625W_100PPM; Component Kind: Standard; Component Type: Standard; Footprint: RESC1005X40N; Pin Count: 2; Value: 510; Status: Not recommended; Power: 0.0625W; Tolerance: ±1%; Manufacturer Part Number: R0402_510R_1%_0.0625W_100PPM; Case: 0402; Mounted: Yes; Socket: No; SMD: Yes; Manufacturer1 Example: PHYCOMP; Manufacturer1 ComponentHeight: 0.4mm; HelpURL: \\cern.ch\dfs\Applications\Altium\Datasheets\R0402_Phycomp_RC0402.pdf; Author: CERN DEM JLC; CreateDate: 2007-12-03; LatestRevisionDate: 2008-03-13
R244 R307 R308 = R0603_2K2_1%_0.1W_100PPM: Resistor - 1%; Part Description: General Purpose Thick Film Chip Resistor; Manufacturer: GENERIC; Manufacturer1 Part Number: NRC06F2201TRF; Power: 0.1W; TC: ±100ppm/°C; Table: Resistors SMD; Part Number: R0603_2K2_1%_0.1W_100PPM; Component Kind: Standard; Component Type: Standard; Pin Count: 2; Value: 2k2; Status: Preferred; Tolerance: ±1%; Manufacturer Part Number: R0603_2K2_1%_0.1W_100PPM; Case: 0603; Mounted: Yes; Socket: No; SMD: Yes; Manufacturer1 Example: NIC COMPONENT; Manufacturer1 ComponentHeight: 0.55mm; HelpURL: \\cern.ch\dfs\Applications\Altium\Datasheets\R0603_NIC_NRC.pdf; Author: CERN DEM JLC; CreateDate: 2007-12-03; LatestRevisionDate: 2008-03-13
R246 = R0603_9K1_1%_0.1W_100PPM: Resistor - 1%; Part Description: General Purpose Thick Film Chip Resistor; Manufacturer: GENERIC; Manufacturer1 Part Number: NRC06F9101TRF; Power: 0.1W; TC: ±100ppm/°C; Table: Resistors SMD; Part Number: R0603_9K1_1%_0.1W_100PPM; Component Kind: Standard; Component Type: Standard; Footprint: RESC1608X55N; Pin Count: 2; Value: 9k1; Status: Preferred; Tolerance: ±1%; Manufacturer Part Number: R0603_9K1_1%_0.1W_100PPM; Mounted: Yes; Socket: No; SMD: Yes; Manufacturer1 Example: NIC COMPONENT; Manufacturer1 ComponentHeight: 0.55mm; HelpURL: \\cern.ch\dfs\Applications\Altium\Datasheets\R0603_NIC_NRC.pdf; Author: CERN DEM JLC; CreateDate: 2007-12-03; LatestRevisionDate: 2008-03-13
R289 R290 = RES_0402: SMD Resistor; Supplier 1: Newark; Supplier Part Number 1: 59M6691

## Sheet SUP_1V.SchDoc
size A4; DocumentNumber: 14; SheetNumber: 14; SheetTotal: 30
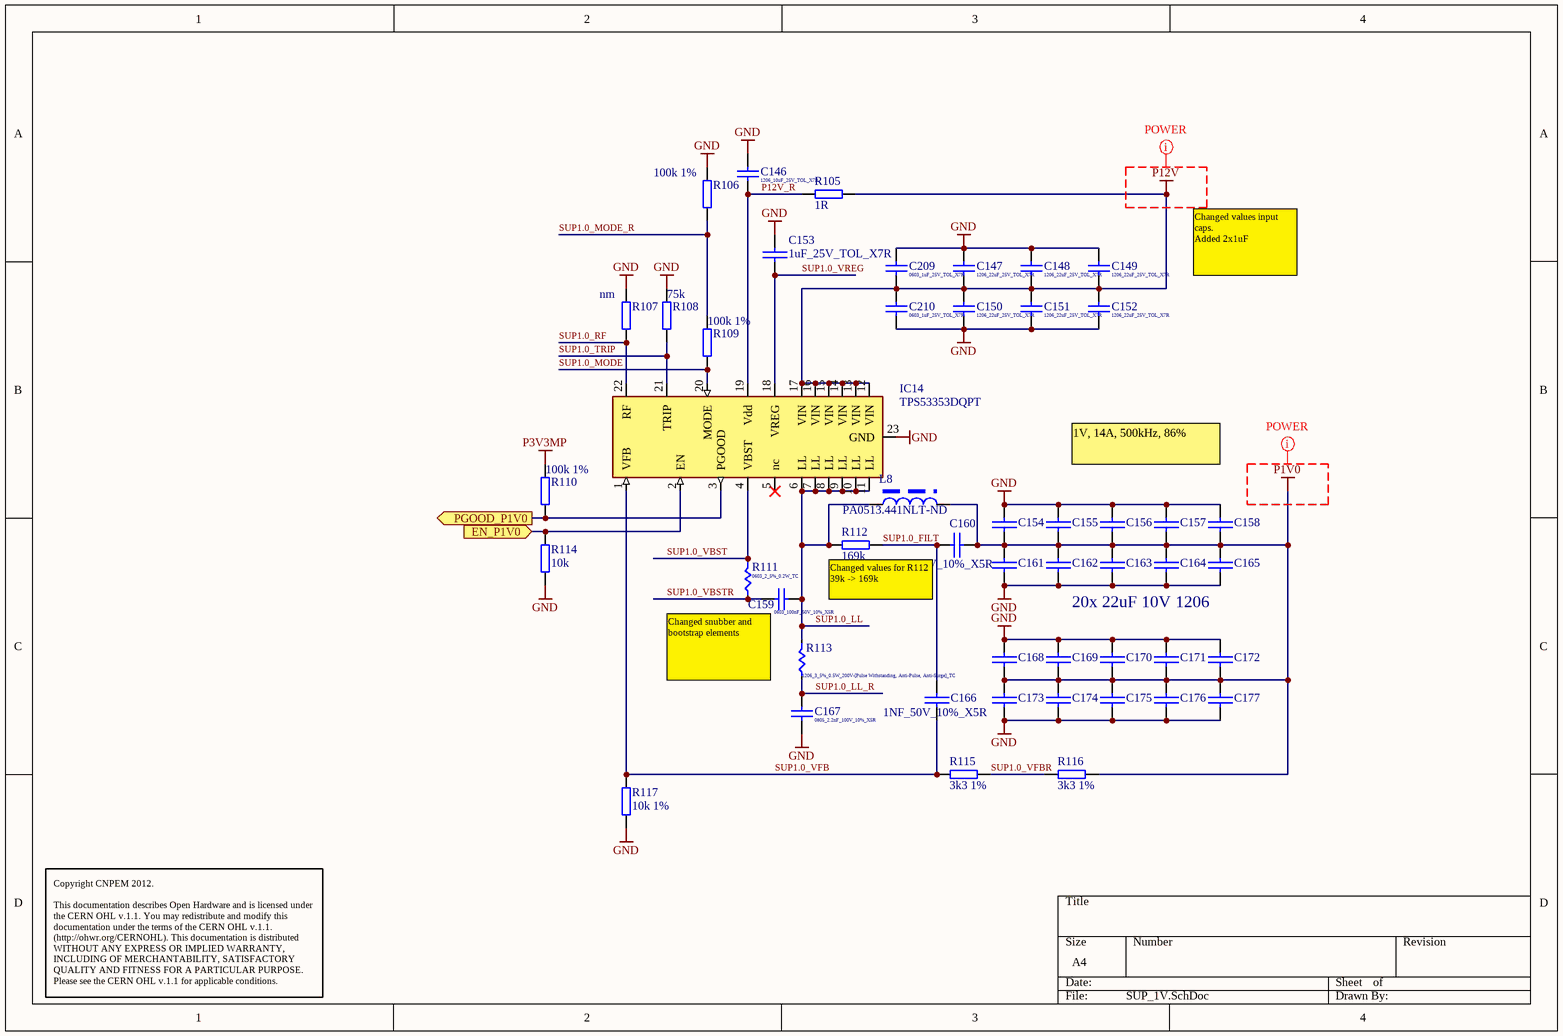
[diagram p18: SUP_1V.SchDoc]

### Parts
C146  1206_10uF_25V_TOL_X7R  [CAPC3225X140N]
C147  1206_22uF_25V_TOL_X7R  [CAPC3225X140N]
C148  1206_22uF_25V_TOL_X7R  [CAPC3225X140N]
C149  1206_22uF_25V_TOL_X7R  [CAPC3225X140N]
C150  1206_22uF_25V_TOL_X7R  [CAPC3225X140N]
C151  1206_22uF_25V_TOL_X7R  [CAPC3225X140N]
C152  1206_22uF_25V_TOL_X7R  [CAPC3225X140N]
C153  1uF_25V_TOL_X7R  [0603C]
C154  22UF_10V_10%_X7R  [1206C]  (value not drawn)
C155  22UF_10V_10%_X7R  [1206C]  (value not drawn)
C156  22UF_10V_10%_X7R  [1206C]  (value not drawn)
C157  22UF_10V_10%_X7R  [1206C]  (value not drawn)
C158  22UF_10V_10%_X7R  [1206C]  (value not drawn)
C159  0603_100nF_50V_10%_X5R  [CAPC1608X90N]
C160  22NF_50V_10%_X5R  [0402C]
C161  22UF_10V_10%_X7R  [1206C]  (value not drawn)
C162  22UF_10V_10%_X7R  [1206C]  (value not drawn)
C163  22UF_10V_10%_X7R  [1206C]  (value not drawn)
C164  22UF_10V_10%_X7R  [1206C]  (value not drawn)
C165  22UF_10V_10%_X7R  [1206C]  (value not drawn)
C166  1NF_50V_10%_X5R  [0402C]
C167  0805_2.2nF_100V_10%_X5R  [CAPC2012X140N]
C168  22UF_10V_10%_X7R  [1206C]  (value not drawn)
C169  22UF_10V_10%_X7R  [1206C]  (value not drawn)
C170  22UF_10V_10%_X7R  [1206C]  (value not drawn)
C171  22UF_10V_10%_X7R  [1206C]  (value not drawn)
C172  22UF_10V_10%_X7R  [1206C]  (value not drawn)
C173  22UF_10V_10%_X7R  [1206C]  (value not drawn)
C174  22UF_10V_10%_X7R  [1206C]  (value not drawn)
C175  22UF_10V_10%_X7R  [1206C]  (value not drawn)
C176  22UF_10V_10%_X7R  [1206C]  (value not drawn)
C177  22UF_10V_10%_X7R  [1206C]  (value not drawn)
C209  0603_1uF_25V_TOL_X7R  [CAPC1608X90N]
C210  0603_1uF_25V_TOL_X7R  [CAPC1608X90N]
IC14  TPS53353DQPT  [LCCS50P600X500X150-22N]
L8  PA0513.441NLT-ND  [IND_PA0513]
R105  1R  [0603R]
R106  100k 1%  [0603R]
R107  nm  [0603R]
R108  75k  [0603R]
R109  100k 1%  [0603R]
R110  100k 1%  [0603R]
R111  0603_2_5%_0.2W_TC  [RESC1608X64N]
R112  169k  [0603R]
R113  1206_3_5%_0.5W_200V-[Pulse Withstanding, Anti-Pulse, Anti-Surge]_TC  [RESC3216X80N]
R114  10k  [0402R]
R115  3k3 1%  [0603R]
R116  3k3 1%  [0603R]
R117  10k 1%  [0603R]

### Ports
EN_P1V0 (in), PGOOD_P1V0 (out)

### Nets
GND: C146.2 C147.2 C148.2 C149.2 C150.1 C151.1 C152.1 C153.1 C154.1 C155.1 C156.1 C157.1 C158.1 C161.2 C162.2 C163.2 C164.2 C165.2 C167.1 C168.1 C169.1 C170.1 C171.1 C172.1 C173.2 C174.2 C175.2 C176.2 C177.2 C209.2 C210.1 IC14.23(GND) R106.2 R107.2 R108.2 R114.1 R117.2
P1V0: C154.2 C155.2 C156.2 C157.2 C158.2 C160.2 C161.1 C162.1 C163.1 C164.1 C165.1 C168.2 C169.2 C170.2 C171.2 C172.2 C173.1 C174.1 C175.1 C176.1 C177.1 L8.2 R116.2
P3V3MP: R110.2
P12V: C147.1 C148.1 C149.1 C150.2 C151.2 C152.2 C209.1 C210.2 IC14.12(VIN) IC14.13(VIN) IC14.14(VIN) IC14.15(VIN) IC14.16(VIN) IC14.17(VIN) R105.1
P12V_R: C146.1 IC14.19(Vdd) R105.2
PM.EN_P1V0: IC14.2(EN) R114.2 ; port EN_P1V0
PM.PGOOD_P1V0: IC14.3(PGOOD) R110.1 ; port PGOOD_P1V0
SUP1.0_FILT: C160.1 C166.2 R112.1
SUP1.0_LL: C159.1 IC14.6(LL) IC14.7(LL) IC14.8(LL) IC14.9(LL) IC14.10(LL) IC14.11(LL) L8.1 R112.2 R113.1(+)
SUP1.0_LL_R: C167.2 R113.2(-)
SUP1.0_MODE: IC14.20(MODE) R109.1
SUP1.0_MODE_R: R106.1 R109.2
SUP1.0_RF: IC14.22(RF) R107.1
SUP1.0_TRIP: IC14.21(TRIP) R108.1
SUP1.0_VBST: IC14.4(VBST) R111.1(+)
SUP1.0_VBSTR: C159.2 R111.2(-)
SUP1.0_VFB: C166.1 IC14.1(VFB) R115.1 R117.1
SUP1.0_VFBR: R115.2 R116.1
SUP1.0_VREG: C153.2 IC14.18(VREG)

Not connected (* = marked no-connect by the designer): IC14 5(nc)*

### Layout directives
net class POWER: P1V0, P12V

### Notes on the sheet
- Changed values input caps.
  Added 2x1uF
- 1V, 14A, 500kHz, 86%
- Changed values for R112 39k -> 169k
- 20x 22uF 10V 1206
- Changed snubber and bootstrap elements
- Copyright CNPEM 2012.
  This documentation describes Open Hardware and is licensed under the CERN OHL v.1.1. You may redistribute and modify this documentation under the terms of the CERN OHL v.1.1. (http://ohwr.org/CERNOHL). This documentation is distributed WITHOUT ANY EXPRESS OR IMPLIED WARRANTY, INCLUDING OF MERCHANTABILITY, SATISFACTORY QUALITY AND FITNESS FOR A PARTICULAR PURPOSE. Please see the CERN OHL v.1.1 for applicable conditions.

### Library data of the parts
C146-C152 = Ceramic_1206: MiscInfo: Biggest Cern Footprint [max height]; Document Name: SUP_1V.SchDoc; Part Number: Ceramic_1206; FootprintSizeX (mm): 4.65; FootprintSizeY (mm): 2.3; FootprintRectangleArea (mm): 10.7; Thickness (Max) (mm): 1.8; FootprintAlias: 1206
C153 = CAP_SMD_0603: Capacitor SMD; Supplier 1: Digi-Key; Supplier Part Number 1: 490-1524-2-ND
C154-C158 C161-C165 C168-C177 = CAP_SMD_1206: Capacitor SMD; Supplier 1: Newark; Supplier Part Number 1: 90R7810
C159 C209 C210 = Ceramic_0603: MiscInfo: Biggest Cern Footprint [max height]; Document Name: SUP_1V.SchDoc; Part Number: Ceramic_0603; FootprintSizeX (mm): 3; FootprintSizeY (mm): 1.5; FootprintRectangleArea (mm): 4.5; Thickness (Max) (mm): 0.9; FootprintAlias: 0603
C160 C166 = CAP_SMD_0402: Capacitor SMD; Supplier 1: Newark; Supplier Part Number 1: 14T3275
C167 = Ceramic_0805: MiscInfo: Biggest Cern Footprint [max height]; Document Name: SUP_1V.SchDoc; Part Number: Ceramic_0805; FootprintSizeX (mm): 3.5; FootprintSizeY (mm): 2; FootprintRectangleArea (mm): 7; Thickness (Max) (mm): 1.4; FootprintAlias: 0805
IC14 = PM_TPS53353: High-Efficiency 20-A Synchronous Buck Converter with Eco-mode™; Supplier 1: Digi-Key; Supplier Part Number 1: 296-29490-1-ND
L8 = L_POWER_PA1513_440nH: 440nH, 30A, 0.32mOhm; Supplier 1: Mouser; Supplier Part Number 1: 673-PA0513.441NLT
R105-R110 R112 R115-R117 = RES_0603: SMD Resistor; Supplier 1: Newark; Supplier Part Number 1: 39K0073
R111 = SMT_0603: MiscInfo: Biggest Cern Footprint [max height]; Document Name: SUP_1V.SchDoc; Part Number: SMT_0603; FootprintSizeX (mm): 3; FootprintSizeY (mm): 1.5; FootprintRectangleArea (mm): 4.5; Thickness (Max) (mm): 0.64; FootprintAlias: 0603
R113 = SMT_1206: MiscInfo: Biggest Cern Footprint [max height]; Document Name: SUP_1V.SchDoc; Part Number: SMT_1206; FootprintSizeX (mm): 4.8; FootprintSizeY (mm): 2.4; FootprintRectangleArea (mm): 11.52; Thickness (Max) (mm): 0.8; FootprintAlias: 1206
R114 = RES_0402: SMD Resistor; Supplier 1: Newark; Supplier Part Number 1: 59M6691

## Sheet UI_mon.SchDoc
size A4; DocumentNumber: 28; SheetNumber: 28; SheetTotal: 30
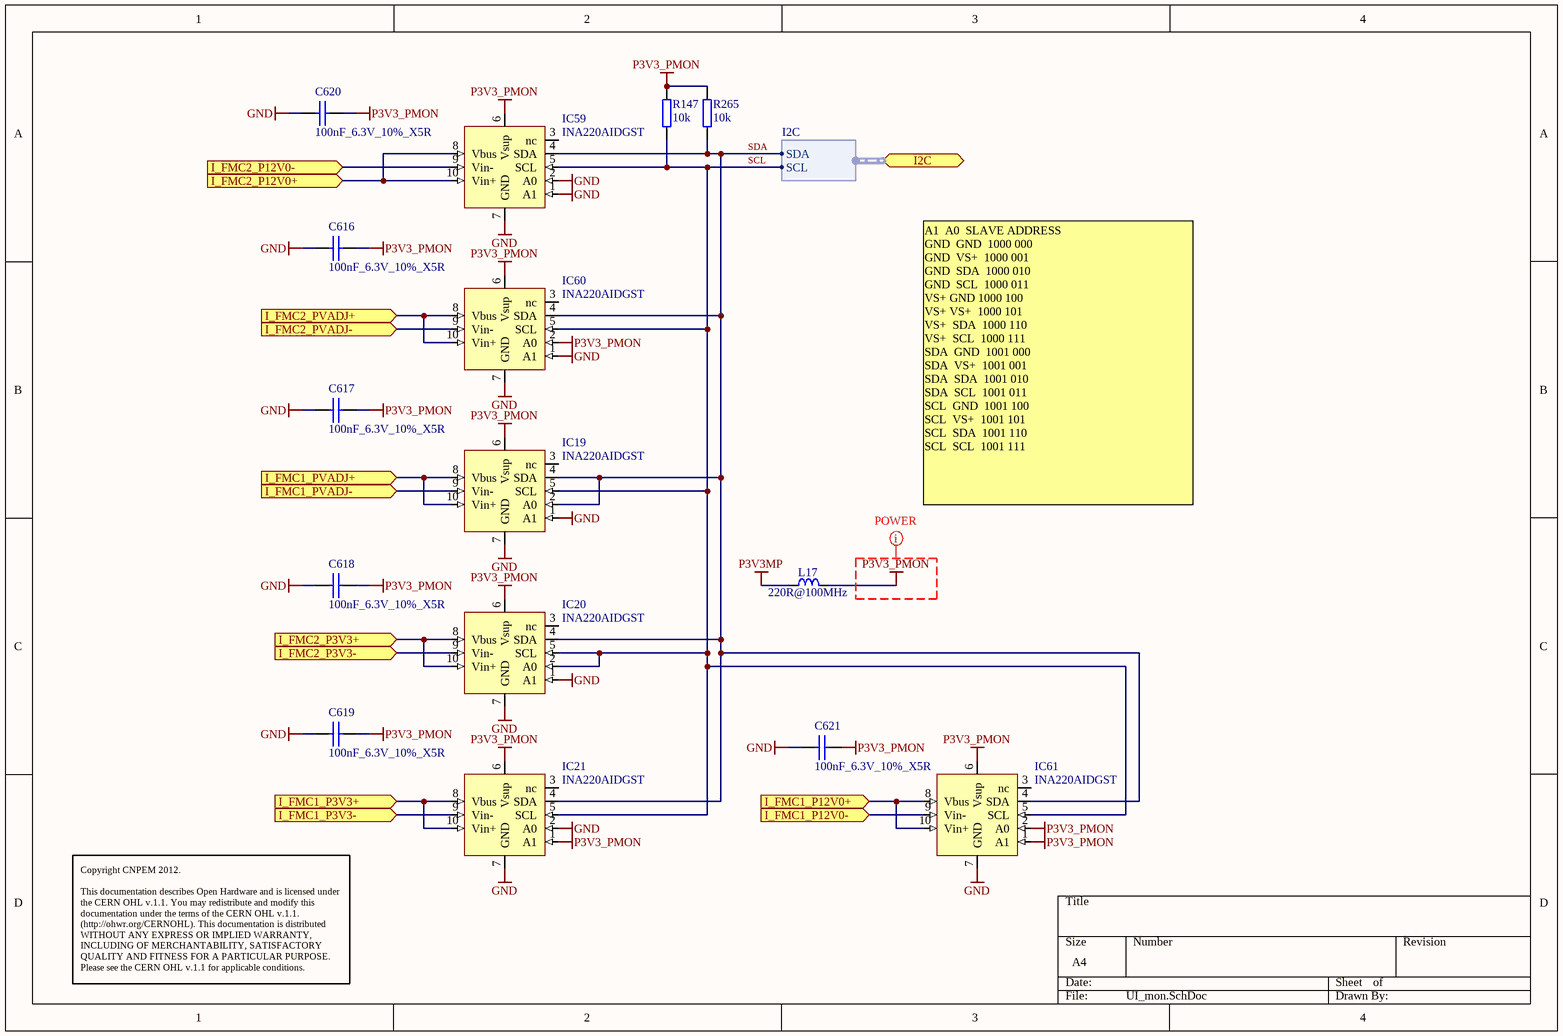
[diagram p19: UI_mon.SchDoc]

### Parts
C616  100nF_6.3V_10%_X5R  [0201C]
C617  100nF_6.3V_10%_X5R  [0201C]
C618  100nF_6.3V_10%_X5R  [0201C]
C619  100nF_6.3V_10%_X5R  [0201C]
C620  100nF_6.3V_10%_X5R  [0201C]
C621  100nF_6.3V_10%_X5R  [0201C]
IC19  INA220AIDGST  [msop10]
IC20  INA220AIDGST  [msop10]
IC21  INA220AIDGST  [msop10]
IC59  INA220AIDGST  [msop10]
IC60  INA220AIDGST  [msop10]
IC61  INA220AIDGST  [msop10]
L17  220R@100MHz  [0603L]
R147  10k  [0402R]
R265  10k  [0402R]

### Ports
I2C (harness I2C), I_FMC1_P3V3+ (in), I_FMC1_P3V3- (in), I_FMC1_P12V0+ (in), I_FMC1_P12V0- (in), I_FMC1_PVADJ+ (in), I_FMC1_PVADJ- (in), I_FMC2_P3V3+ (in), I_FMC2_P3V3- (in), I_FMC2_P12V0+ (in), I_FMC2_P12V0- (in), I_FMC2_PVADJ+ (in), I_FMC2_PVADJ- (in)

### Harnesses
I2C: SCL, SDA

### Nets
GND: C616.2 C617.2 C618.2 C619.2 C620.2 C621.2 IC19.1(A1) IC19.7(GND) IC20.1(A1) IC20.7(GND) IC21.2(A0) IC21.7(GND) IC59.1(A1) IC59.2(A0) IC59.7(GND) IC60.1(A1) IC60.7(GND) IC61.7(GND)
P3V3_PMON: C616.1 C617.1 C618.1 C619.1 C620.1 C621.1 IC19.6(Vsup) IC20.6(Vsup) IC21.1(A1) IC21.6(Vsup) IC59.6(Vsup) IC60.2(A0) IC60.6(Vsup) IC61.1(A1) IC61.2(A0) IC61.6(Vsup) L17.2 R147.2 R265.2
P3V3MP: L17.1
I_FMC1_P3V3n: IC21.9(Vin-) ; port I_FMC1_P3V3-
I_FMC1_P3V3p: IC21.8(Vbus) IC21.10(Vin+) ; port I_FMC1_P3V3+
I_FMC1_P12V0+: IC61.8(Vbus) IC61.10(Vin+) ; port I_FMC1_P12V0+
I_FMC1_P12V0-: IC61.9(Vin-) ; port I_FMC1_P12V0-
I_FMC1_PADJn: IC19.9(Vin-) ; port I_FMC1_PVADJ-
I_FMC1_PADJp: IC19.8(Vbus) IC19.10(Vin+) ; port I_FMC1_PVADJ+
I_FMC2_P3V3n: IC20.9(Vin-) ; port I_FMC2_P3V3-
I_FMC2_P3V3p: IC20.8(Vbus) IC20.10(Vin+) ; port I_FMC2_P3V3+
I_FMC2_P12V0+: IC59.8(Vbus) IC59.10(Vin+) ; port I_FMC2_P12V0+
I_FMC2_P12V0-: IC59.9(Vin-) ; port I_FMC2_P12V0-
I_FMC2_PADJn: IC60.9(Vin-) ; port I_FMC2_PVADJ-
I_FMC2_PADJp: IC60.8(Vbus) IC60.10(Vin+) ; port I_FMC2_PVADJ+
SCL: IC19.5(SCL) IC20.2(A0) IC20.5(SCL) IC21.5(SCL) IC59.5(SCL) IC60.5(SCL) IC61.5(SCL) R147.1 ; port I2C.SCL  [project net I2C_CPU.SCL]
SDA: IC19.2(A0) IC19.4(SDA) IC20.4(SDA) IC21.4(SDA) IC59.4(SDA) IC60.4(SDA) IC61.4(SDA) R265.1 ; port I2C.SDA  [project net I2C_CPU.SDA]

Not connected (* = marked no-connect by the designer): IC19 3(nc); IC20 3(nc); IC21 3(nc); IC59 3(nc); IC60 3(nc); IC61 3(nc)

### Layout directives
net class POWER: P3V3_PMON

### Notes on the sheet
- A1 	A0 	SLAVE ADDRESS
  GND 	GND 	1000 000
  GND 	VS+ 	1000 001
  GND 	SDA 	1000 010
  GND 	SCL 	1000 011
  VS+	GND	1000 100
  VS+	VS+ 	1000 101
  VS+ 	SDA 	1000 110
  VS+ 	SCL 	1000 111
  SDA 	GND 	1001 000
  SDA 	VS+ 	1001 001
  SDA 	SDA 	1001 010
  SDA 	SCL 	1001 011
  SCL 	GND 	1001 100
  SCL 	VS+ 	1001 101
  SCL 	SDA 	1001 110
  SCL 	SCL 	1001 111
- Copyright CNPEM 2012.
  This documentation describes Open Hardware and is licensed under the CERN OHL v.1.1. You may redistribute and modify this documentation under the terms of the CERN OHL v.1.1. (http://ohwr.org/CERNOHL). This documentation is distributed WITHOUT ANY EXPRESS OR IMPLIED WARRANTY, INCLUDING OF MERCHANTABILITY, SATISFACTORY QUALITY AND FITNESS FOR A PARTICULAR PURPOSE. Please see the CERN OHL v.1.1 for applicable conditions.

### Library data of the parts
C616-C621 = CAP_SMD_0201: Capacitor SMD
IC19-IC21 IC59-IC61 = ADC_INA220: CURRENT/POWER MONITOR with Two-Wire Interface
L17 = IND0805_MURATA_BLM21PG221SN1D: Inductor; Part Description: SMD EMIFIL Suppression Chip Bead Ferrite; Manufacturer: MURATA; Power: 2A; Resistance: 0.05R; Tolerance: ±25%; Table: Inductors SMD; Part Number: IND0805_MURATA_BLM21PG221SN1D; Component Kind: Standard; Component Type: Standard; Footprint: INDC2012X105N; Pin Count: 2; Value: 220R@100MHz; Status: None; Manufacturer Part Number: BLM21PG221SN1D; Case: 0805; Mounted: Yes; Socket: No; SMD: Yes; ComponentHeight: 1.05mm; HelpURL: \\cern.ch\dfs\Applications\Altium\Datasheets\IND0402_MURATA_BLM21P.pdf; Author: CERN DEM JLC; CreateDate: 2010-01-25; LatestRevisionDate: 2010-01-25
R147 R265 = RES_0402: SMD Resistor; Supplier 1: Newark; Supplier Part Number 1: 59M6691